# EasyEDA schematic SCH_Astavel and Monostable Clock Circuit - 2.0_2021-10-05.json
TITLE: Sistema de Clock Astavel e Manual; REV: 2.0; Date: 2021-09-19; Sheet: 1/1; Drawn By: Marcos Silva D. S.

## Parts
C1  10uF 25V TANTALUM  [CAP-TH_BD4.0-P1.50-D0.8-FD]
C2  10nF 63V poli  [CAP-TH_L5.5-W3.0-P5.00-D0.5]
C3  10nF 63V poli  [CAP-TH_L5.5-W3.0-P5.00-D0.5]
C4  330nF 63V poli  [CAP-TH_L5.5-W3.0-P5.00-D0.5]
C5  100nF 63V poli  [CAP-TH_L5.5-W3.0-P5.00-D0.5]
C6  100nF 63V poli  [CAP-TH_L5.5-W3.0-P5.00-D0.5]
C7  100nF 63V poli  [CAP-TH_L5.5-W3.0-P5.00-D0.5]
IC1  74LS04  [DIL-14]
KEY1  button6*6*8.5  [KEY-TH_4P-L6.0-W6.0-P4.50]
LED1  VERDE  [LED-TH_BD3.0-P2.54-RD-GREEN]
R1  150  [RES-TH_BD3.0-L9.5-P13.50-D0.6]
R2  10  [RES-TH_BD3.0-L9.5-P13.50-D0.6]
R3  100K LINEAR  [RES-ADJ-TH_3362P]
R4  10K  [RES-TH_BD3.0-L9.5-P13.50-D0.6]
R5  330K  [RES-TH_BD3.0-L9.5-P13.50-D0.6]
R6  470  [RES-TH_BD3.0-L9.5-P13.50-D0.6]
S1  SWITCH-SPDT  [SWITCH-SPDT-SMD]
U1  NE556N  [DIP-14_L19.0-W7.0-P2.54-LS7.6-BL]
U2  74LS00  [DIP-14_L19.4-W6.4-P2.54-LS7.6-BL]
U3  ALIM  [HDR-TH_4P-P2.54-D1.0]
U5  SINAIS OUT  [HDR-TH_4P-P2.54-D1.0]

## Library data of the parts
C1 = SK100M035B070A: Supplier: LCSC; Manufacturer: CapXon; Supplier Part: C62931; JLCPCB Part Class: Extended Part
C2-C7 = 0.01uF(103) 100V: Supplier: LCSC; Manufacturer: ReliaPro; Supplier Part: C10722
IC1 = DM74LS04N: Contributor: keyboardjunkie
KEY1 = button6*6*8.5: Supplier Part: C59980; Supplier: LCSC; Manufacturer: ReliaPro
LED1 = 264-7GD: Supplier: LCSC; Supplier Part: C605465; Manufacturer: Everlight Elec; Contributor: LCSC; JLCPCB Part Class: Extended Part
R1 R2 R4-R6 = 750Ω: Supplier: LCSC; Manufacturer Part: 7501/2w5%; Supplier Part: C48642
R3 = 3362P-1-502LF: Supplier: LCSC; Manufacturer: BOURNS; Supplier Part: C81260; Resistance(Ohms): 5K
S1 = SWITCH-SPDT: Contributor: SparkFun
U1 = NE556N: Supplier: LCSC; Manufacturer: TI; Supplier Part: C66175; JLCPCB Part Class: Extended Part
U2 = XD74LS04: Supplier: LCSC; Supplier Part: C513524; Manufacturer: XINLUDA(信路达); Contributor: LCSC; JLCPCB Part Class: Extended Part
U3 U5 = 171825-4: Supplier: LCSC; Supplier Part: C210162; Manufacturer: TE Connectivity; Contributor: LCSC; JLCPCB Part Class: Extended Part

## Nets
+5V: C5.1 C6.1 C7.1 IC1.14(Vcc) R1.1 R4.1 R5.1 S1.1(O) U1.4(1RESET) U1.10(2RESET) U1.14(VCC) U2.14(1Y) U3.1 U3.2
GND: C1.2 C2.2 C3.1 C4.2 C5.2 C6.2 C7.2 IC1.7(GND) KEY1.3 R6.2 S1.3(S) U1.7(GND) U2.7(4A) U3.3 U3.4
/CLOCK: IC1.9 U2.8(4Y) U5.2
HLT: IC1.5 U5.3
Net-(C1-1): C1.1 R3.1 R3.2 U1.2(1THRES) U1.6(1TRIG)
Net-(C2-1): C2.1 U1.3(1CONT)
Net-(C3-2): C3.2 U1.11(2CONT)
Net-(C4-1): C4.1 R5.2 U1.12(2THRES) U1.13(2DISCH)
Net-(IC1-1): IC1.1 U1.5(1OUT)
Net-(IC1-2): IC1.2 U2.1(1A)
Net-(IC1-3): IC1.3 IC1.10 U2.2(2Y)
Net-(IC1-4): IC1.4 U2.4(VCC)
Net-(IC1-6): IC1.6 U2.9(5A)
Net-(IC1-8): IC1.8 LED1.2(+) U5.1
Net-(IC1-11): IC1.11 IC1.12
Net-(IC1-13): IC1.13 S1.2(P)
Net-(KEY1-1): KEY1.1 R4.2 U1.8(2TRIG)
Net-(LED1-1): LED1.1(-) R6.1
Net-(R1-2): R1.2 R2.1 U1.1(1DISCH)
Net-(R2-2): R2.2 R3.3
Net-(U1-9): U1.9(2OUT) U2.5(3A)
Net-(U2-3): U2.3(2A) U2.13(6A)
Net-(U2-6): U2.6(3Y) U2.12(6Y)
Net-(U2-10): U2.10(5Y) U2.11(GND)

Not connected (* = marked no-connect by the designer): KEY1 2 4; U5 4

## Notes on the sheet
- 1 - +5V
- 2 - +5V LOOP
- 3 - GND
- 4 - GND LOOP
- 1 - CLOCK
- 2 - /CLOCK
- 3 - SINAL HLT
- 4 - NULL
